# Altium schematic sheet output1.SchDoc
size A4
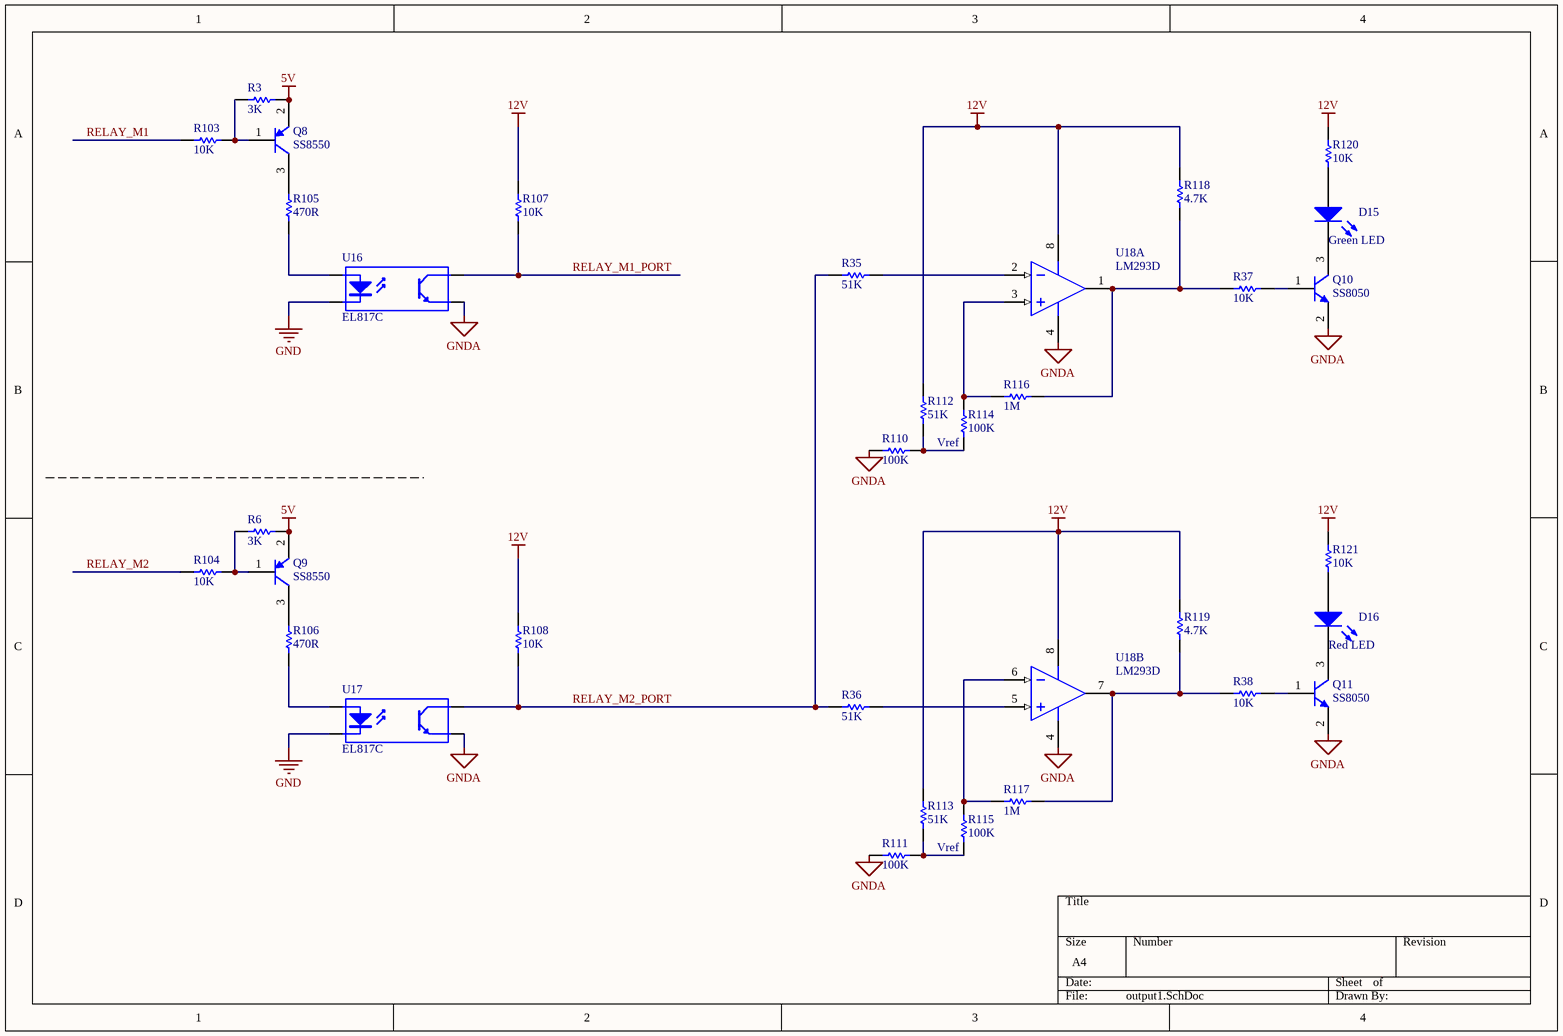
[diagram p0: output1.SchDoc]

## Parts
D15  Green LED  [LED254A]
D16  Red LED  [LED254A]
Q8  SS8550  [SOT-23_N]
Q9  SS8550  [SOT-23_N]
Q10  SS8050  [SOT-23_N]
Q11  SS8050  [SOT-23_N]
R3  3K  [RESC2012M]
R6  3K  [RESC2012M]
R35  51K  [RESC2012M]
R36  51K  [RESC2012M]
R37  10K  [RESC2012M]
R38  10K  [RESC2012M]
R103  10K  [RESC2012M]
R104  10K  [RESC2012M]
R105  470R  [RESC2012M]
R106  470R  [RESC2012M]
R107  10K  [RESC2012M]
R108  10K  [RESC2012M]
R110  100K  [RESC2012M]
R111  100K  [RESC2012M]
R112  51K  [RESC2012M]
R113  51K  [RESC2012M]
R114  100K  [RESC2012M]
R115  100K  [RESC2012M]
R116  1M  [RESC2012M]
R117  1M  [RESC2012M]
R118  4.7K  [RESC2012M]
R119  4.7K  [RESC2012M]
R120  10K  [RESC2012M]
R121  10K  [RESC2012M]
U16  EL817C  [SO-4LA]
U17  EL817C  [SO-4LA]
U18  LM293D  [SO8_N]  (parts A,B of 2)

## Nets
5V: Q8.2(E) Q9.2(E) R3.1 R6.1
12V: R107.2 R108.2 R112.2 R113.2 R118.1 R119.1 R120.2 R121.2 U18.8(V+)
GND: U16.2(K) U17.2(K)
GNDA: Q10.2(E) Q11.2(E) R110.1 R111.1 U16.3(E) U17.3(E) U18.4(V-)
RELAY_M1: R103.1
RELAY_M1_PORT: R107.1 U16.4(C)
RELAY_M2: R104.1
RELAY_M2_PORT: R35.1 R36.2 R108.1 U17.4(C)
NetD15_1: D15.1(A) R120.1
NetD15_2: D15.2(K) Q10.3(C)
NetD16_1: D16.1(A) R121.1
NetD16_2: D16.2(K) Q11.3(C)
NetQ8_1: Q8.1(B) R3.2 R103.2
NetQ8_3: Q8.3(C) R105.1
NetQ9_1: Q9.1(B) R6.2 R104.2
NetQ9_3: Q9.3(C) R106.1
NetQ10_1: Q10.1(B) R37.1
NetQ11_1: Q11.1(B) R38.2
NetR35_2: R35.2 U18.2(IN-)
NetR36_1: R36.1 U18.5(IN+)
NetR37_2: R37.2 R116.2 R118.2 U18.1(OUT)
NetR38_1: R38.1 R117.2 R119.2 U18.7(OUT)
NetR105_2: R105.2 U16.1(A)
NetR106_2: R106.2 U17.1(A)
NetR110_2: R110.2 R112.1 R114.2
NetR111_2: R111.2 R113.1 R115.2
NetR114_1: R114.1 R116.1 U18.3(IN+)
NetR115_1: R115.1 R117.1 U18.6(IN-)

## Notes on the sheet
- (near R114) Vref
- (near R115) Vref

## Library data of the parts
D15 = LED1: Green LED ,SIP, Dia =3mm; Published: 8-Jun-2000; LatestRevisionDate: 08-Jul-2005; LatestRevisionNote: Mech Layer 1 removed.; PackageReference: LED-1; Publisher: Altium Limited
D16 = LED1: Red LED ,SIP, Dia =3mm; Published: 8-Jun-2000; LatestRevisionDate: 08-Jul-2005; LatestRevisionNote: Mech Layer 1 removed.; PackageReference: LED-1; Publisher: Altium Limited
Q8 Q9 = 2N3906: PNP General Purpose Amplifier; Published: 8-Jun-2000; LatestRevisionDate: 15-Jan-2003; LatestRevisionNote: PCB Footprint 'BCY-W3/D4.7' replaced; DatasheetVersion: 1997; PackageVersion: Sep-1998; PackageReference: TO-92A; Publisher: Altium Limited; Code_JEDEC: TO-92A; ComponentLink1Description: Manufacturer Link; ComponentLink1URL: http://www.fairchildsemi.com/; ComponentLink2Description: Datasheet; ComponentLink2URL: http://www.fairchildsemi.com/ds/2N%2F2N3906.pdf
Q10 Q11 = PMMT491A: NPN BISS Transistor; Published: 17-Sep-2003; LatestRevisionDate: 12-Dec-2006; LatestRevisionNote: IPC-7351 Footprint Added.; DatasheetVersion: 11-Jun-2001; PackageVersion: May-1999; PackageReference: SOT23; Publisher: Altium Limited; PackageDescription: 3-Pin SOT-23 Package 0.95 mm Pitch, 2.3 mm Lead Span; ComponentLink1Description: Manufacturer Link; ComponentLink1URL: http://www.semiconductors.philips.com/; ComponentLink2Description: Datasheet; ComponentLink2URL: http://www.semiconductors.philips.com/acrobat/datasheets/PMMT491A_5.pdf
R3 R6 R35 R36 R105 R106 R110-R119 = Res1: Resistor; Value: 10K; Published: 8-Jun-2000; LatestRevisionDate: 17-Jul-2002; LatestRevisionNote: Re-released for DXP Platform.; PackageReference: AXIAL-0.3; Publisher: Altium Limited
R37 R38 R103 R104 R107 R108 R120 R121 = Res1: Resistor; Published: 8-Jun-2000; LatestRevisionDate: 17-Jul-2002; LatestRevisionNote: Re-released for DXP Platform.; PackageReference: AXIAL-0.3; Publisher: Altium Limited; Value: 10K
U16 U17 = Optoisolator1: 4-Pin Phototransistor Optocoupler; Published: 24-Mar-1999; LatestRevisionDate: 04-Mar-2005; LatestRevisionNote: Sch pins 3 & 4 Swapped.; DatasheetVersion: Nov-2003; PackageReference: DIP-4; Publisher: Altium Limited
U18 = LM293D: Low-Power Dual Voltage Comparator; Published: 24-Aug-2001; LatestRevisionDate: 13-Apr-2006; LatestRevisionNote: IPC-7351 Footprint Added.; DatasheetVersion: Jun-1998; PackageVersion: Dec-2002; PackageReference: SO8; Publisher: Altium Limited; PackageDescription: 8-Pin Small Outline Integrated Circuit 1.27 mm Pitch; Code_JEDEC: MS-012-AA; Code_IPC: SOIC127P600-8; ComponentLink1Description: Manufacturer Link; ComponentLink1URL: http://www.st.com/; ComponentLink2Description: Datasheet; ComponentLink2URL: http://www.st.com/stonline/products/literature/ds/2164/lm293.pdf